# EAGLE design AUX power board (EAGLE 7.5.0)
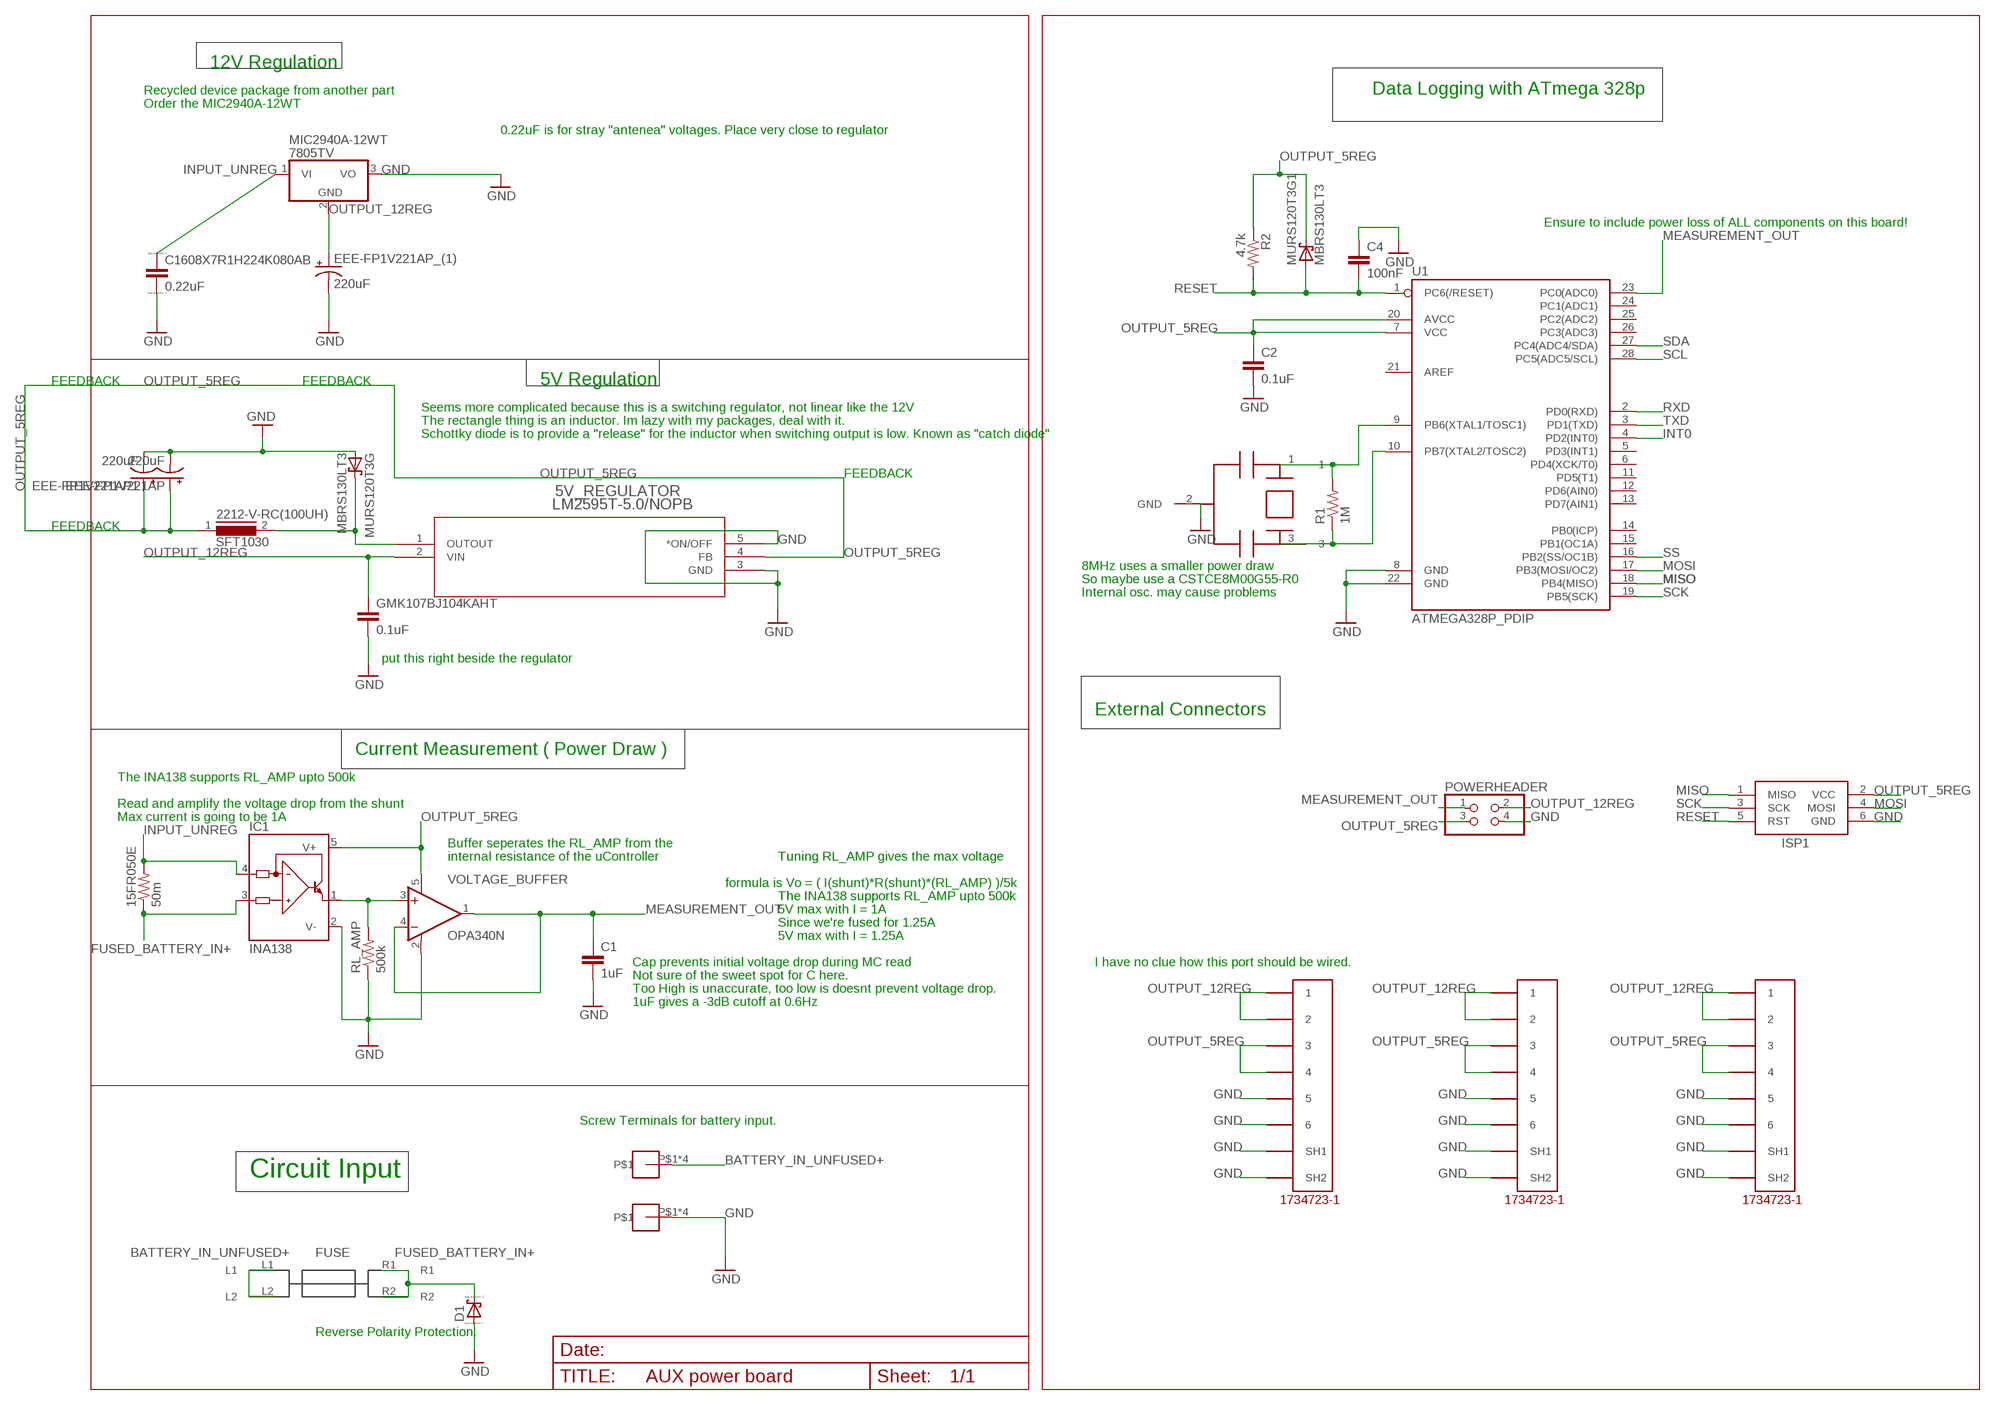
[diagram p0: schematic, sheet 1]

## Parts
5V_REGULATOR  LM2595T-5.0/NOPB  [T05D]
15FR050E  50m  R-US_0617/22  [0617/22]
2212-V-RC(100UH)  SFT1030  [SFT1030]
C1  1uF  C-EUC0603  [C0603]
C2  0.1uF  C-EUC0603  [C0603]
C4  100nF  C-EUC0603  [C0603]
C1608X7R1H224K080AB  0.22uF  CC0603  [C0603]
D1  SCHOTTKY-DIODESMC  [DIODE_SMC]
EEE-FP1V221AP  220uF  CPOL-US175TMP-0808  [175TMP-0808]
EEE-FP1V221AP1  220uF  CPOL-US175TMP-0808  [175TMP-0808]
EEE-FP1V221AP_(1)  220uF  CPOL-US175TMP-0808  [175TMP-0808]
GMK107BJ104KAHT  0.1uF  C-EUC0603  [C0603]
IC1  INA138  [SOT23-5]
ISP1  AVRISP-6  [AVRISP]
MIC2940A-12WT  7805TV  [TO220V]
MINIBLADE  3568  [3568]
MURS120T3G  MBRS130LT3  [SMB]
MURS120T3G1  MBRS130LT3  [SMB]
POWERHEADER  PINHD-2X2  [2X02]
R1  1M  R-US_R0603  [R0603]
R2  4.7k  R-US_R0603  [R0603]
RL_AMP  500k  R-US_R0603  [R0603]
U1  ATMEGA328P_PDIP  [DIL28-3]
U$1  CSTCE16M0V53-R0  [RESONATOR]
U$3  5555140-6  [1734723-1_RJ11]
U$4  5555140-6  [1734723-1_RJ11]
U$5  5555140-6  [1734723-1_RJ11]
U$6  SCREW-8191  [SCREW-8191]
U$7  SCREW-8191  [SCREW-8191]
VOLTAGE_BUFFER  OPA340N  [SOT23-5]

## Nets
BATTERY_IN_UNFUSED+: MINIBLADE.L1 MINIBLADE.L2 U$6.P$1 U$6.P$2 U$6.P$3 U$6.P$4
FUSED_BATTERY_IN+: 15FR050E.1 D1.C(A) IC1.3(IN+) MINIBLADE.R1 MINIBLADE.R2
GND: 5V_REGULATOR.3(GND) 5V_REGULATOR.5(*ON/OFF) C1.2 C2.2 C4.1 C1608X7R1H224K080AB.2 D1.A(C) EEE-FP1V221AP1.- EEE-FP1V221AP.- EEE-FP1V221AP_(1).- GMK107BJ104KAHT.2 IC1.2(V-) ISP1.6(GND) MIC2940A-12WT.3(VO) MURS120T3G.A POWERHEADER.4 RL_AMP.1 U1.8(GND) U1.22(GND) U$1.2(GND) U$3.5 U$3.6 U$3.SH1 U$3.SH2 U$4.5 U$4.6 U$4.SH1 U$4.SH2 U$5.5 U$5.6 U$5.SH1 U$5.SH2 U$7.P$1 U$7.P$2 U$7.P$3 U$7.P$4 VOLTAGE_BUFFER.2(V-)
INPUT_UNREG: 15FR050E.2 C1608X7R1H224K080AB.1 IC1.4(IN-) MIC2940A-12WT.1(VI)
INT0: U1.4(PD2(INT0))
MEASUREMENT_OUT: C1.1 POWERHEADER.1 U1.23(PC0(ADC0)) VOLTAGE_BUFFER.1(OUT) VOLTAGE_BUFFER.4(-IN)
MISO: ISP1.1(MISO) U1.18(PB4(MISO))
MOSI: ISP1.4(MOSI) U1.17(PB3(MOSI/OC2))
N$1: 5V_REGULATOR.1(OUTOUT) 2212-V-RC(100UH).2 MURS120T3G.C
N$3: IC1.1(OUT) RL_AMP.2 VOLTAGE_BUFFER.3(+IN)
N$18: R1.2 U1.9(PB6(XTAL1/TOSC1)) U$1.1
N$19: R1.1 U1.10(PB7(XTAL2/TOSC2)) U$1.3
OUTPUT_5REG: 5V_REGULATOR.4(FB) 2212-V-RC(100UH).1 C2.1 EEE-FP1V221AP1.+ EEE-FP1V221AP.+ IC1.5(V+) ISP1.2(VCC) MURS120T3G1.C POWERHEADER.3 R2.1 U1.7(VCC) U1.20(AVCC) U$3.3 U$3.4 U$4.3 U$4.4 U$5.3 U$5.4 VOLTAGE_BUFFER.5(V+)
OUTPUT_12REG: 5V_REGULATOR.2(VIN) EEE-FP1V221AP_(1).+ GMK107BJ104KAHT.1 MIC2940A-12WT.2(GND) POWERHEADER.2 U$3.1 U$3.2 U$4.1 U$4.2 U$5.1 U$5.2
RESET: C4.2 ISP1.5(RST) MURS120T3G1.A R2.2 U1.1(PC6(/RESET))
RXD: U1.2(PD0(RXD))
SCK: ISP1.3(SCK) U1.19(PB5(SCK))
SCL: U1.28(PC5(ADC5/SCL))
SDA: U1.27(PC4(ADC4/SDA))
SS: U1.16(PB2(SS/OC1B))
TXD: U1.3(PD1(TXD))
Unconnected: U1.5(PD3(INT1)) U1.6(PD4(XCK/T0)) U1.11(PD5(T1)) U1.12(PD6(AIN0)) U1.13(PD7(AIN1)) U1.14(PB0(ICP)) U1.15(PB1(OC1A)) U1.21(AREF) U1.24(PC1(ADC1)) U1.25(PC2(ADC2)) U1.26(PC3(ADC3))

## Notes on the sheet
- 12V Regulation
- Recycled device package from another part | Data Logging with ATmega 328p
- Order the MIC2940A-12WT
- 0.22uF is for stray "antenea" voltages. Place very close to regulator
- Ensure to include power loss of ALL components on this board!
- FEEDBACK | FEEDBACK | 5V Regulation
- Seems more complicated because this is a switching regulator, not linear like the 12V
- The rectangle thing is an inductor. Im lazy with my packages, deal with it.
- Schottky diode is to provide a "release" for the inductor when switching output is low. Known as "catch diode"
- FEEDBACK
- FEEDBACK
- 8MHz uses a smaller power draw
- So maybe use a CSTCE8M00G55-R0
- Internal osc. may cause problems
- put this right beside the regulator
- External Connectors
- Current Measurement ( Power Draw )
- The INA138 supports RL_AMP upto 500k
- Read and amplify the voltage drop from the shunt
- Max current is going to be 1A
- Buffer seperates the RL_AMP from the
- internal resistance of the uController | Tuning RL_AMP gives the max voltage
- formula is Vo = ( I(shunt)*R(shunt)*(RL_AMP) )/5k
- The INA138 supports RL_AMP upto 500k
- 5V max with I = 1A
- Since we're fused for 1.25A
- 5V max with I = 1.25A
- Cap prevents initial voltage drop during MC read | I have no clue how this port should be wired.
- Not sure of the sweet spot for C here.
- Too High is unaccurate, too low is doesnt prevent voltage drop.
- 1uF gives a -3dB cutoff at 0.6Hz
- Screw Terminals for battery input.
- Circuit Input
- Reverse Polarity Protection.

## Library data of the parts
5V_REGULATOR = LM2595T-5:LM2595T-5.0/NOPB; COPYRIGHT: Copyright C 2015 Accelerated Designs. All rights reserved; MANUFACTURER_PART_NUMBER: LM2595T50; VENDOR: National Semiconductor
15FR050E R2 RL_AMP = resistor:R-US_: RESISTOR, American symbol
2212-V-RC(100UH) = inductors:SFT1030: INDUCTOR
C1 C2 = resistor:C-EU: CAPACITOR, European symbol
C4 GMK107BJ104KAHT = rcl:C-EU: CAPACITOR, European symbol
C1608X7R1H224K080AB = eagle-ltspice:C: CAPACITOR, European symbol; SPICEMODEL: NONE; SPICEPREFIX: C
D1 = eagle-ltspice:SCHOTTKY-DIODE: Schottky Diode; SPICEMODEL: NONE; SPICEPREFIX: D; SPICETYPE: diode
EEE-FP1V221AP EEE-FP1V221AP1 EEE-FP1V221AP_(1) = rcl:CPOL-US: POLARIZED CAPACITOR, American symbol
IC1 = burr-brown:INA138: High-Side Measurement Current Shunt Monitor; MF: TEXAS INSTRUMENTS; MPN: INA138NA/250; OC_FARNELL: 1564888; OC_NEWARK: 80K5906
ISP1 = adafruit:AVRISP: AVR ISP HEADER Standard 6 pin header for AVR programming
MIC2940A-12WT = linear:78*: Positive VOLTAGE REGULATOR Source: http://cache.national.com/ds/LM/LM78L05.pdf http://www.fairchildsemi.com/ds/LM/LM7805.pdf
MINIBLADE = fuse:3568
MURS120T3G MURS120T3G1 = diode:MBRS130LT3: Schottky Power Rectifier Source: http://www.onsemi.com/pub/Collateral/MBRS130LT3-D.PDF
POWERHEADER = pinhead:PINHD-2X2: PIN HEADER
R1 = rcl:R-US_: RESISTOR, American symbol
U1 = SparkFun-DigitalIC:ATMEGA328P_PDIP: uC used in the Arduino 32kb flash, 1k EEPROM, 2k SRAM This is the through-hole version of this chip.
U$1 = arduino_Uno_Rev3-02-TH:CSTCE16M0V53-R0
U$3-U$5 = 5555140-6 RJ11:5555140-6
U$6 U$7 = Shell2013:SCREW-8191
VOLTAGE_BUFFER = burr-brown:OPA340: Rail-to-Rail Operational Amplifiers Single-Supply, MicroAmplifier(TM) Series; MPN: OPA340NA/3KG4; OC_FARNELL: 1234805; OC_NEWARK: 13M5177

## Board
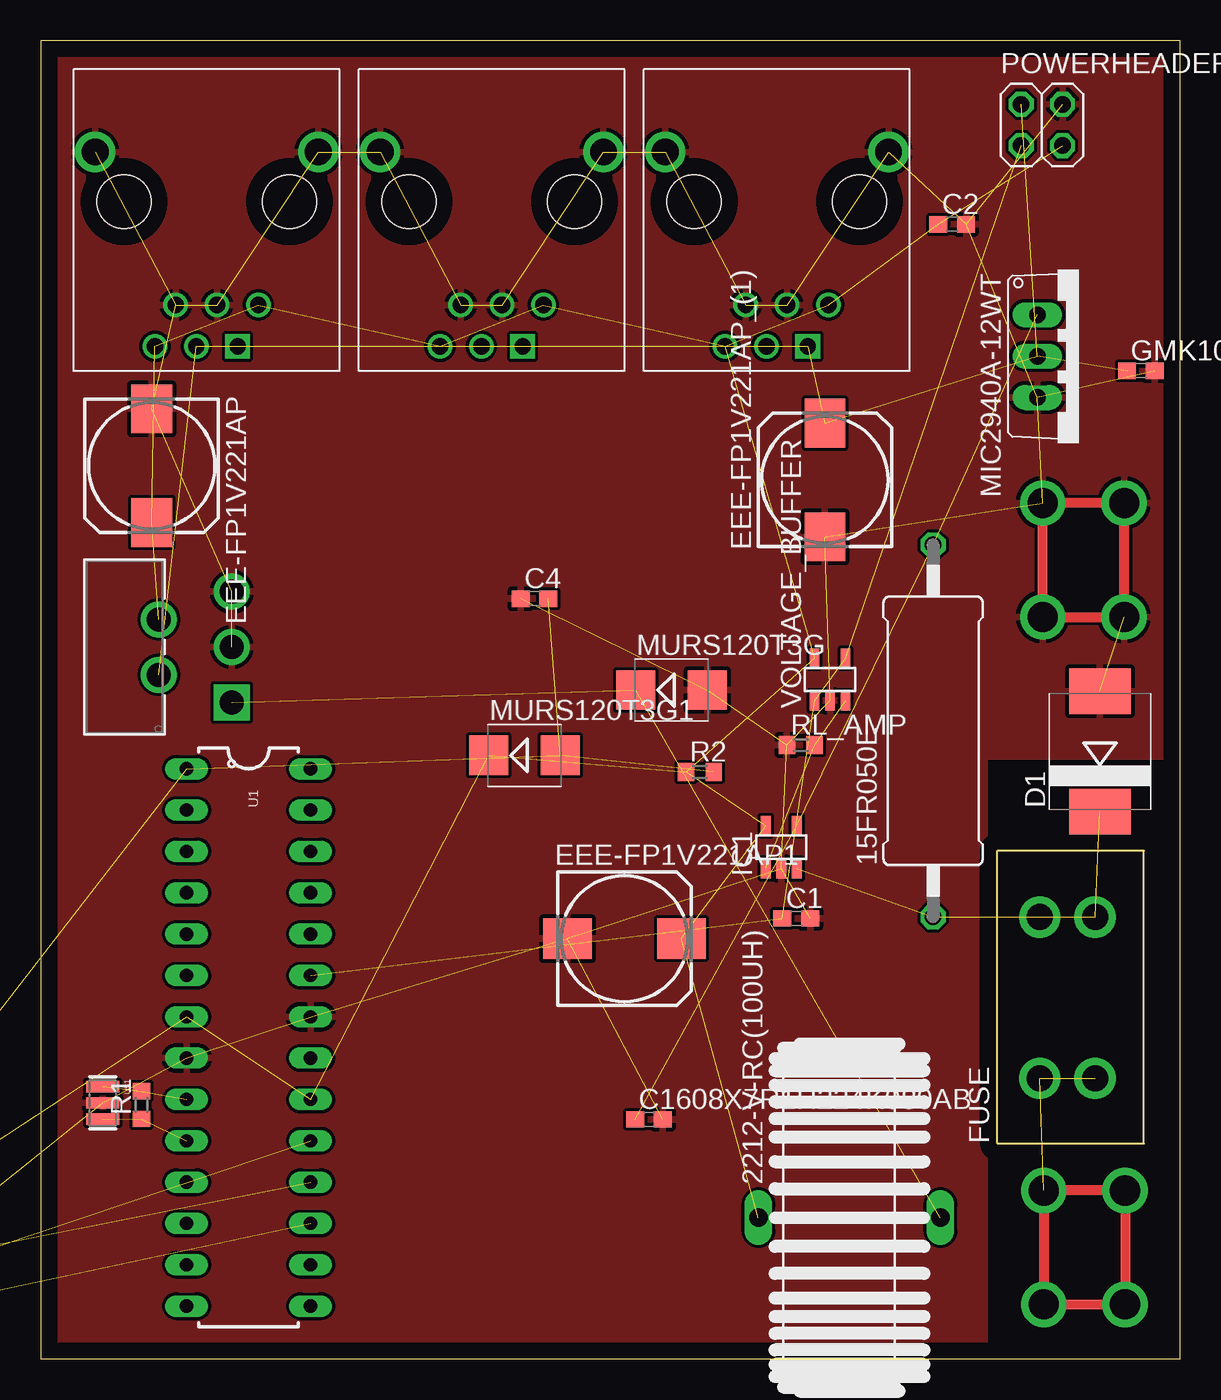
[diagram p1: board, top side]
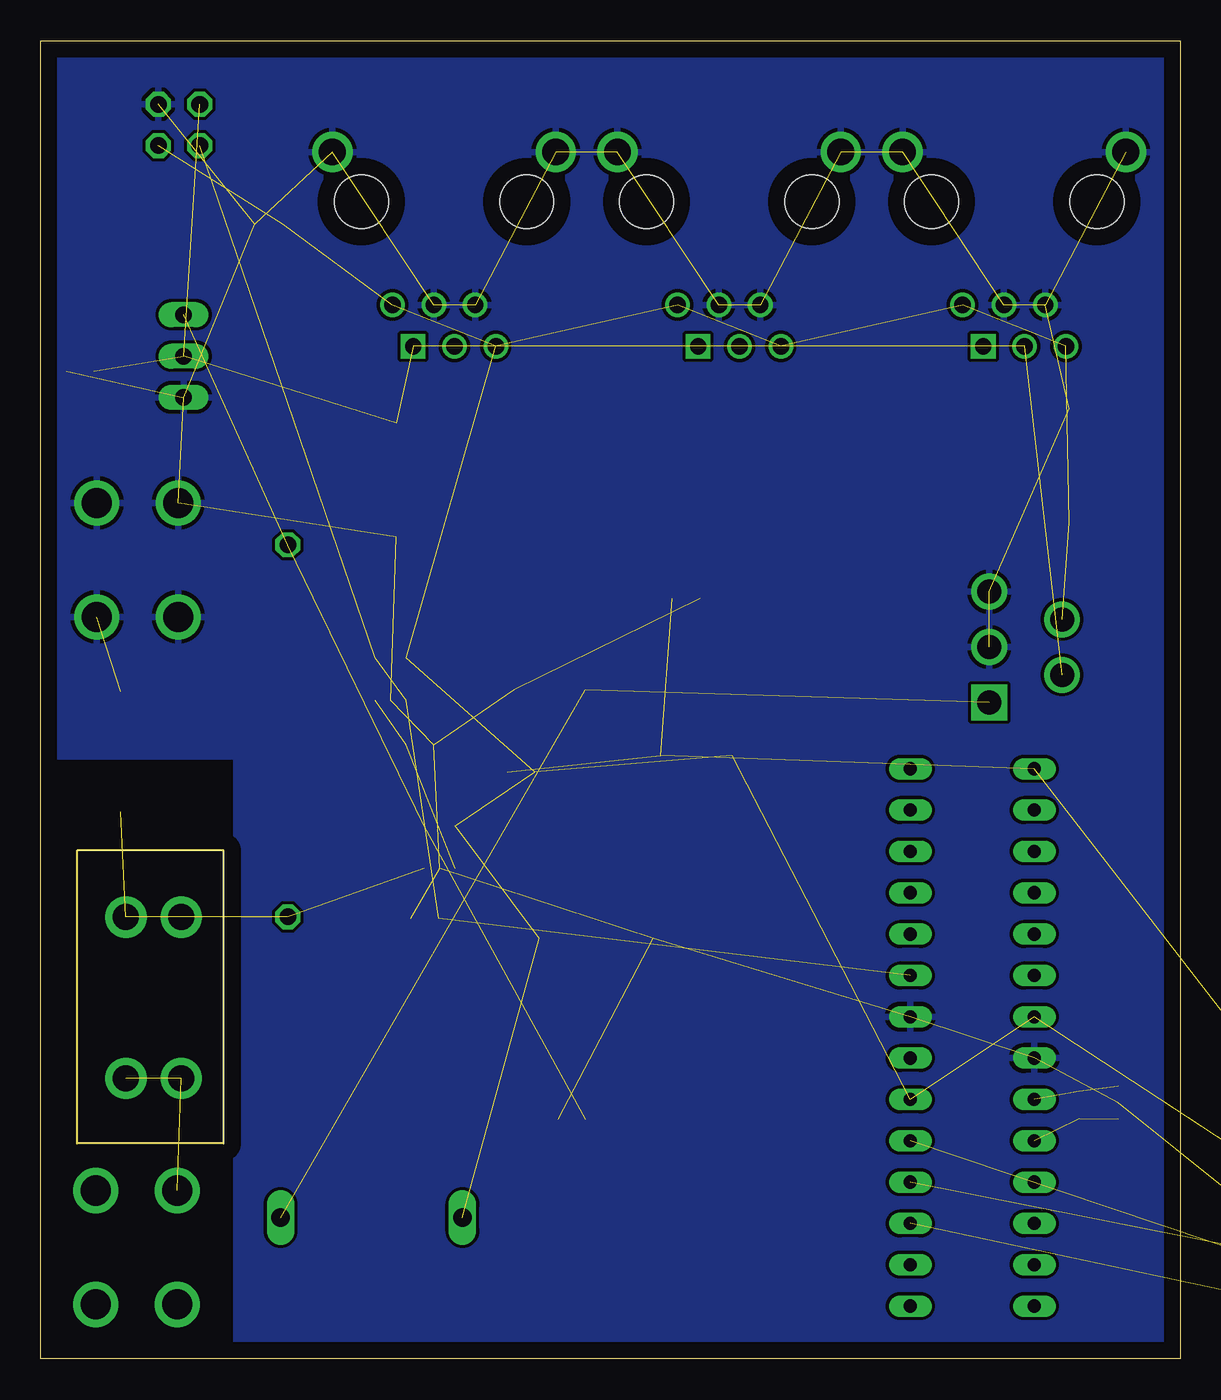
[diagram p2: board, bottom side, seen from below]

Size 70 x 81 mm. Coordinates in mm from the lower left corner, seen from the top.
Outline: 0,0 70,0 70,81 0,81 0,0
Copper layers (1*16): Top 0.035mm / dielectric 1.5mm / Bottom 0.035mm
Design rules "default": minimum track width 10mil, minimum drill 24mil, track to track 8mil, track to pad 8mil, pad to pad 8mil, via to via 8mil, smd to smd 8mil, copper to edge 40mil, drill to drill 8mil, minimum pad ring 10mil, minimum via ring 8mil, stop-mask expansion 4mil, vias tented up to drill 0mil, thermal gap 10mil

### Footprints (pad centres in the part's own frame; a part is rotated, then mirrored left to right if it is on the bottom)
T05D = drill 1.473 pad 1.981 square: 1 -6.807,-13.183 | drill 1.473 pad 1.981: 2 -5.105,-8.712; 3 -3.404,-13.183; 4 -1.702,-8.712; 5 0,-13.183
0617/22 = drill 1.016 octagon: 1 -11.43,0; 2 11.43,0
SFT1030 = drill 1.118 long: 1 -5.588,0; 2 5.588,0
C0603 = smd 1.1 x 1: 1 -0.85,0; 2 0.85,0
DIODE_SMC = smd 2.8 x 3.8: A 3.7,0; C -3.7,0
175TMP-0808 = smd 3 x 2.5: + 3.5,0; - -3.5,0
SOT23-5 = smd 0.6 x 1.2: 1 -0.95,-1.306; 2 0,-1.306; 3 0.95,-1.306; 4 0.95,1.306; 5 -0.95,1.306
AVRISP = drill 0.9 pad 1.626: 1 -1.27,2.54; 2 1.27,2.54; 3 -1.27,0; 4 1.27,0; 5 -1.27,-2.54; 6 1.27,-2.54
TO220V = drill 1.016 long: 1 -2.54,-2.54; 2 0,-2.54; 3 2.54,-2.54
3568 = drill 1.6 pad 2.54: L1 0,3.4; L2 0,0; R1 9.92,3.4; R2 9.92,0
SMB = smd 2.4 x 2.4: A 2.2,0; C -2.2,0
2X02 = drill 1.016 octagon: 1 -1.27,-1.27; 2 -1.27,1.27; 3 1.27,-1.27; 4 1.27,1.27
R0603 = smd 1 x 1.1: 1 -0.85,0; 2 0.85,0
DIL28-3 = drill 0.813 long: 1 -16.51,-3.81; 2 -13.97,-3.81; 3 -11.43,-3.81; 4 -8.89,-3.81; 5 -6.35,-3.81; 6 -3.81,-3.81; 7 -1.27,-3.81; 8 1.27,-3.81; 9 3.81,-3.81; 10 6.35,-3.81; 11 8.89,-3.81; 12 11.43,-3.81; 13 13.97,-3.81; 14 16.51,-3.81; 15 16.51,3.81; 16 13.97,3.81; 17 11.43,3.81; 18 8.89,3.81; 19 6.35,3.81; 20 3.81,3.81; 21 1.27,3.81; 22 -1.27,3.81; 23 -3.81,3.81; 24 -6.35,3.81; 25 -8.89,3.81; 26 -11.43,3.81; 27 -13.97,3.81; 28 -16.51,3.81
RESONATOR = smd 0.7 x 2: 1 -1,0; 2 0,0; 3 1,0
1734723-1_RJ11 = drill 1 square: 1 -2.54,2.54 | drill 1: 2 0,2.54; 3 2.54,2.54; 4 -3.81,0; 5 -1.27,0; 6 1.27,0 | drill 1.65: SH1 -7.5,-9.4; SH2 6.22,-9.4 | hole 3.3: -5.72,-6.35; 4.44,-6.35
SCREW-8191 = drill 1.85: P$1 0,0; P$2 0,5; P$3 7,5; P$4 7,0

### Placement (x,y rotation side)
5V_REGULATOR  -1.45,47.14 90 top
15FR050E  54.82,38.59 90 top
2212-V-RC(100UH)  49.68,8.68 0 top
C1  46.41,27.06 0 top
C2  55.99,69.71 0 top
C4  30.34,46.71 0 top
C1608X7R1H224K080AB  37.36,14.71 0 top
D1  65.07,37.31 90 top
EEE-FP1V221AP  6.82,54.88 270 top
EEE-FP1V221AP1  35.86,25.82 0 top
EEE-FP1V221AP_(1)  48.17,54.01 90 top
GMK107BJ104KAHT  67.58,60.71 0 top
IC1  45.49,31.44 0 top
ISP1  -19,1 0 top  (outside the outline)
MIC2940A-12WT  63.76,61.61 270 top
MINIBLADE  64.77,17.23 90 top
MURS120T3G  38.74,41.09 0 top
MURS120T3G1  29.71,37.09 0 top
POWERHEADER  61.5,75.82 0 top
R1  6.19,15.6 90 top
R2  40.49,36.06 0 top
RL_AMP  46.69,37.71 0 top
U1  12.77,19.75 270 top
U$1  3.81,15.73 270 top
U$3  9.56,64.76 180 top
U$4  27.07,64.76 180 top
U$5  44.58,64.76 180 top
U$6  66.61,3.34 90 top
U$7  61.55,52.59 270 top
VOLTAGE_BUFFER  48.49,41.75 0 top

### Tracks (layer width: path | path; a pad name or v marks a point on that pad's centre or on a via)
BATTERY_IN_UNFUSED+  (2 unrouted)
FUSED_BATTERY_IN+  (4 unrouted)
GND  (33 unrouted)
  pour Top: -4,84 73,84 73,37 58,37 58,-5 -4,-5
  pour Bottom: -1,83 72,83 72,37 58,37 58,-4 -3,-4 -3,83 -2,83
INPUT_UNREG  (3 unrouted)
MEASUREMENT_OUT  (4 unrouted)
MISO  (1 unrouted)
MOSI  (1 unrouted)
N$1  (2 unrouted)
N$3  (2 unrouted)
N$18  (2 unrouted)
N$19  (2 unrouted)
OUTPUT_5REG  (18 unrouted)
OUTPUT_12REG  (10 unrouted)
RESET  (4 unrouted)
SCK  (1 unrouted)